# Altium schematic sheet PWMSignalSplitter.SchDoc
size Letter
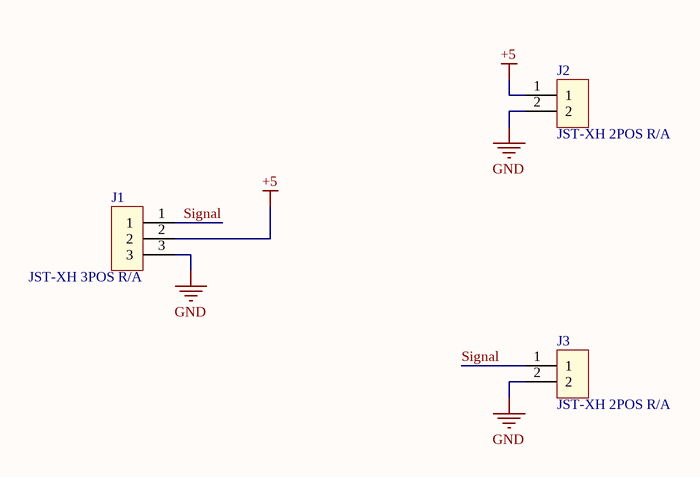
[diagram p0: PWMSignalSplitter.SchDoc]

## Parts
J1  JST-XH 3POS R/A  [S3B-XH-A(LF)(SN)]
J2  JST-XH 2POS R/A  [S2B-XH-A(LF)(SN)]
J3  JST-XH 2POS R/A  [S2B-XH-A(LF)(SN)]

## Nets
+5: J1.2 J2.1
GND: J1.3 J2.2 J3.2
Signal: J1.1 J3.1

## Notes on the sheet
- Title
- Size:
- Date:
- Letter
- Number:
- Time:
- Revision:
- Sheet
- of
- File:

## Library data of the parts
J1 = S3B-XH-A(LF)(SN): JST XH CONN HEADER R/A 3POS 2.5MM; Manufacturer: JST; Part Number: S3B-XH-A(LF)(SN); Value: JST-XH 3POS R/A; ComponentLink1Description: DigiKey; ComponentLink1URL: https://www.digikey.com/en/products/detail/jst-sales-america-inc/S2B-XH-A-LF-SN/1651055
J2 J3 = S2B-XH-A(LF)(SN): JST XH CONN HEADER R/A 2POS 2.5MM; Manufacturer: JST; Part Number: S2B-XH-A(LF)(SN); Value: JST-XH 2POS R/A; ComponentLink1Description: DigiKey; ComponentLink1URL: https://www.digikey.com/en/products/detail/jst-sales-america-inc/S2B-XH-A-LF-SN/1651055